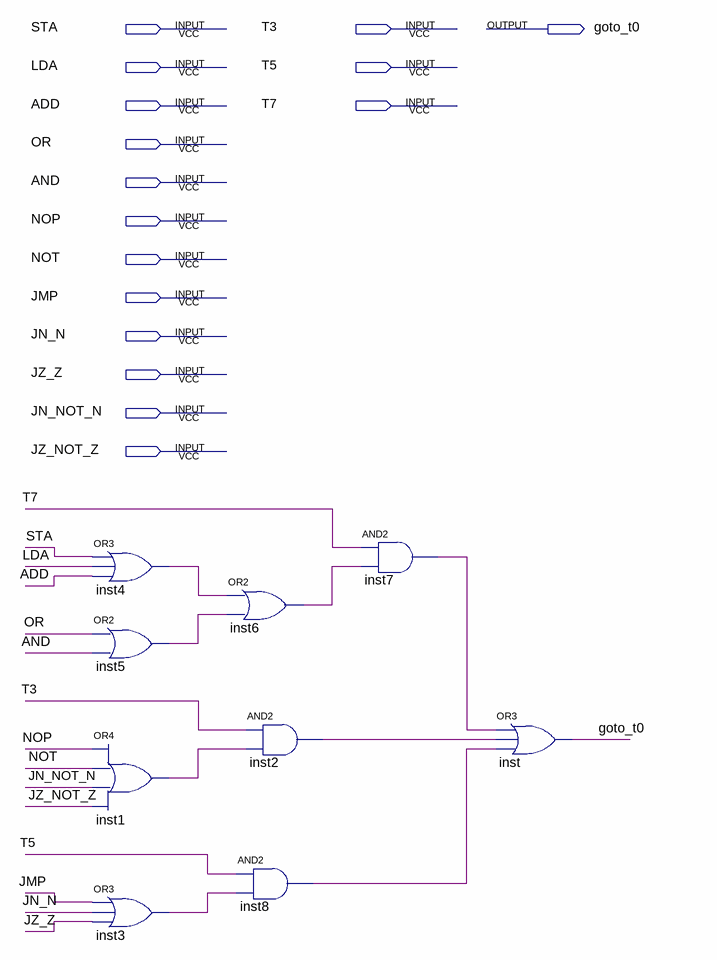
[diagram p0: schematic sheet]
// Quartus schematic goto_t0.bdf as structural Verilog: 9 symbols, 16 pins
module goto_t0 (
  input  STA,
  input  T3,
  input  LDA,
  input  T5,
  input  ADD,
  input  T7,
  input  OR,
  input  AND,
  input  NOP,
  input  NOT,
  input  JMP,
  input  JN_N,
  input  JZ_Z,
  input  JN_NOT_N,
  input  JZ_NOT_Z,
  output goto_t0
);

  wire inst1_out, inst2_out, inst3_out, inst4_out, inst5_out, inst6_out, inst7_out, inst8_out;

  or inst4 (inst4_out, STA, LDA, ADD);
  or inst5 (inst5_out, OR, AND);
  or inst1 (inst1_out, NOP, NOT, JN_NOT_N, JZ_NOT_Z);
  or inst3 (inst3_out, JMP, JN_N, JZ_Z);
  or inst6 (inst6_out, inst4_out, inst5_out);
  and inst2 (inst2_out, T3, inst1_out);
  and inst8 (inst8_out, T5, inst3_out);
  and inst7 (inst7_out, T7, inst6_out);
  or inst (goto_t0, inst7_out, inst2_out, inst8_out);
endmodule
